# Altium schematic sheet PowerBoard.SchDoc
size A4
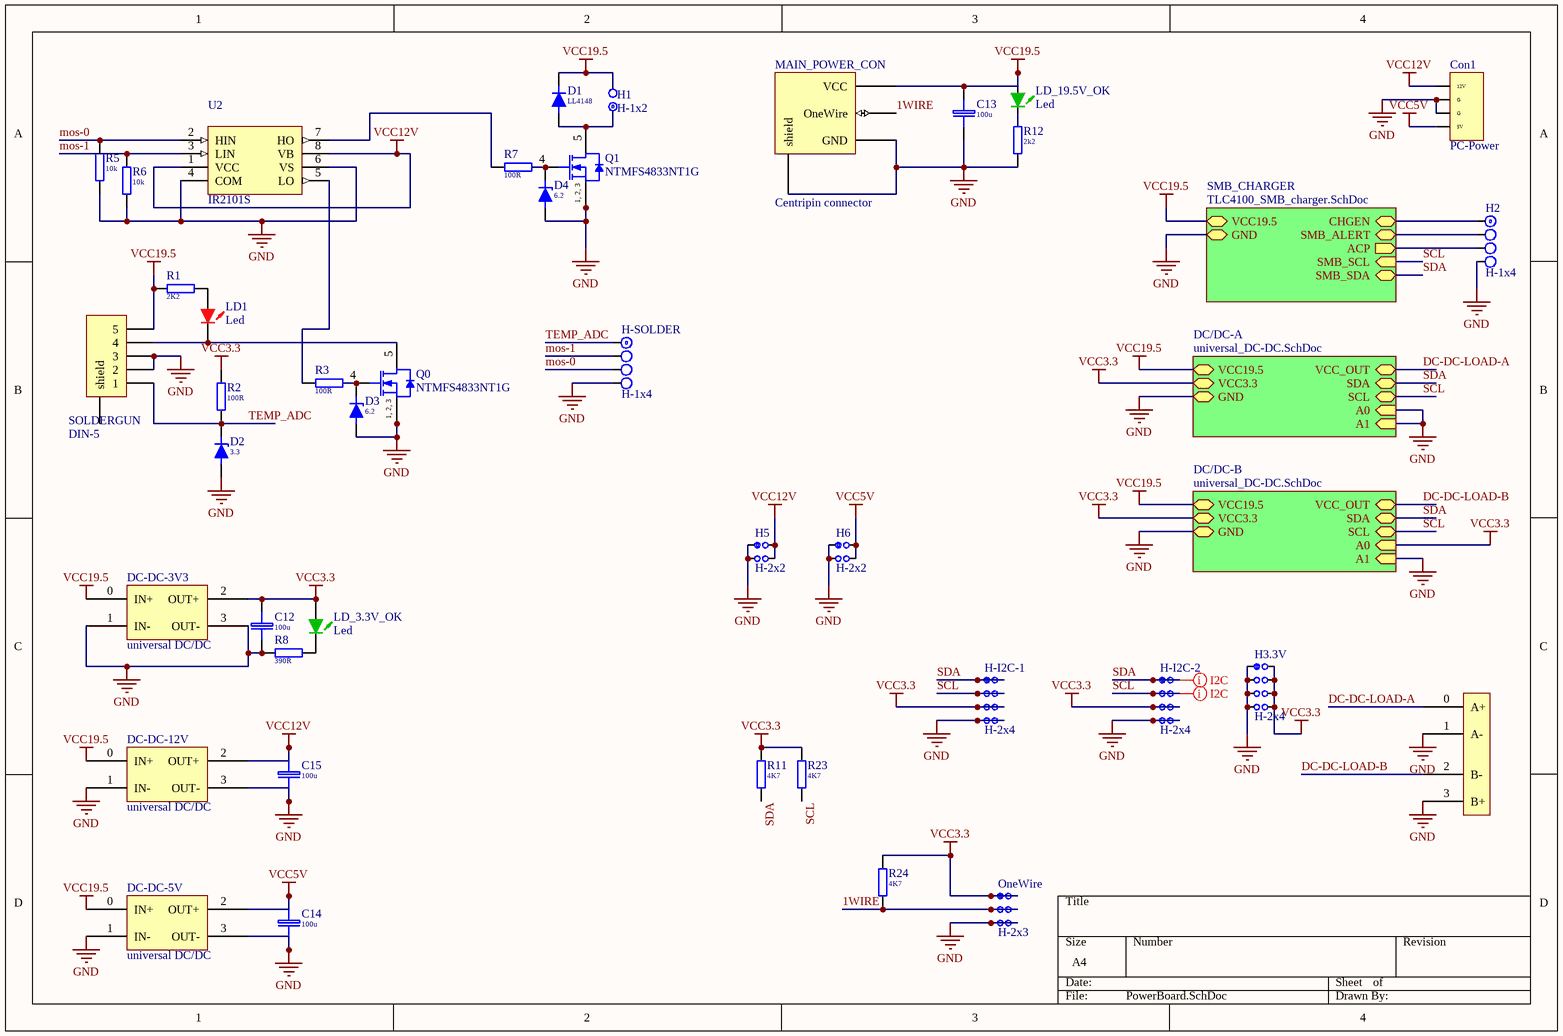
[diagram p0: PowerBoard.SchDoc]

## Parts
C12  100u  [EL SMD Case G D10x10.3 h10.2(1010)]
C13  100u  [EL SMD Case G D10x10.3 h10.2(1010)]
C14  100u  [EL SMD Case G D10x10.3 h10.2(1010)]
C15  100u  [EL SMD Case G D10x10.3 h10.2(1010)]
Con1  PC-Power  [PC-Power 4x5.08]
CON_DC_DC  Speaker terminal 4P  [Speaker termina 4x DPS]  (value not drawn)
D1  LL4148  [Micro-Melf]
D2  3.3  [SOD323]
D3  6.2  [SOD323]
D4  6.2  [SOD323]
DC-DC-3V3  universal DC/DC  [MP1584EN dc/dc 3A vertical]
DC-DC-5V  universal DC/DC  [MP1584EN dc/dc 3A vertical]
DC-DC-12V  universal DC/DC  [MP1584EN dc/dc 3A vertical]
H1  H-1x2  [J1x2]
H2  H-1x4  [J1x4]
H3.3V  H-2x4  [J2x4]
H5  H-2x2  [J2x2]
H6  H-2x2  [J2x2]
H-I2C-1  H-2x4  [J2x4]
H-I2C-2  H-2x4  [J2x4]
H-SOLDER  H-1x4  [J1x4]
LD1  Led  [Led 0805-Red]
LD_3.3V_OK  Led  [Led 0805-Green]
LD_19.5V_OK  Led  [Led 0805-Green]
MAIN_POWER_CON  Centripin connector  [Dell_centripin]
OneWire  H-2x3  [J2x3]
Q0  NTMFS4833NT1G  [ONSC-DFN-5-488AA_V]
Q1  NTMFS4833NT1G  [ONSC-DFN-5-488AA_V]
R1  2K2  [R0805]
R2  100R  [R0805]
R3  100R  [R0805]
R5  10k  [R0805]
R6  10k  [R0805]
R7  100R  [R0805]
R8  390R  [R0805]
R11  4K7  [R0805]
R12  2k2  [R0805]
R23  4K7  [R0805]
R24  4K7  [R0805]
SOLDERGUN  DIN-5  [DIN-5]
U2  IR2101S  [SO-8_L]

## Sub-sheets
DC/DC-A = universal_DC-DC.SchDoc: VCC3.3, SDA, GND, VCC19.5, VCC_OUT, A0 (in), A1 (in), SCL
DC/DC-B = universal_DC-DC.SchDoc: VCC3.3, SDA, GND, VCC19.5, VCC_OUT, A0 (in), A1 (in), SCL
SMB_CHARGER = TLC4100_SMB_charger.SchDoc: SMB_ALERT, CHGEN, ACP (out), VCC19.5, SMB_SCL (in), SMB_SDA, GND

## Nets
GND: C12.2(-) C13.2(-) C14.2(-) C15.2(-) Con1.2(G) Con1.3(G) CON_DC_DC.1(A-) CON_DC_DC.3(B+) D2.1(A) D3.1(A) D4.1(A) DC-DC-3V3.1(IN-) DC-DC-3V3.3(OUT-) DC-DC-5V.1(IN-) DC-DC-5V.3(OUT-) DC-DC-12V.1(IN-) DC-DC-12V.3(OUT-) H2.4 H3.3V.1 H3.3V.3 H3.3V.5 H3.3V.7 H5.1 H5.3 H6.1 H6.3 H-I2C-1.7 H-I2C-1.8 H-I2C-2.7 H-I2C-2.8 H-SOLDER.4 MAIN_POWER_CON.0(shield) MAIN_POWER_CON.1(GND) OneWire.5 OneWire.6 Q0.1(S) Q0.2(S) Q0.3(S) Q1.1(S) Q1.2(S) Q1.3(S) R5.1 R6.1 R8.2 R12.2 SOLDERGUN.2 SOLDERGUN.3 U2.4(COM) U2.6(VS) ; sheet SMB_CHARGER/GND, sheet DC/DC-A/GND, sheet DC/DC-A/A0, sheet DC/DC-A/A1, sheet DC/DC-B/GND, sheet DC/DC-B/A1
VCC3.3: C12.1(+) DC-DC-3V3.2(OUT+) H3.3V.2 H3.3V.4 H3.3V.6 H3.3V.8 H-I2C-1.5 H-I2C-1.6 H-I2C-2.5 H-I2C-2.6 LD_3.3V_OK.1(A) OneWire.1 OneWire.2 R2.2 R11.2 R23.2 R24.2 ; sheet DC/DC-A/VCC3.3, sheet DC/DC-B/VCC3.3, sheet DC/DC-B/A0
VCC5V: C14.1(+) Con1.1(5V) DC-DC-5V.2(OUT+) H6.2 H6.4
VCC12V: C15.1(+) Con1.4(12V) DC-DC-12V.2(OUT+) H5.2 H5.4 U2.1(VCC) U2.8(VB)
VCC19.5: C13.1(+) D1.2(C) DC-DC-3V3.0(IN+) DC-DC-5V.0(IN+) DC-DC-12V.0(IN+) H1.2 LD_19.5V_OK.1(A) MAIN_POWER_CON.3(VCC) R1.2 SOLDERGUN.5 ; sheet SMB_CHARGER/VCC19.5, sheet DC/DC-A/VCC19.5, sheet DC/DC-B/VCC19.5
1WIRE: MAIN_POWER_CON.2(OneWire) OneWire.3 OneWire.4 R24.1
DC-DC-LOAD-A: CON_DC_DC.0(A+) ; sheet DC/DC-A/VCC_OUT
DC-DC-LOAD-B: CON_DC_DC.2(B-) ; sheet DC/DC-B/VCC_OUT
mos-0: H-SOLDER.3 R5.2 U2.2(HIN)
mos-1: H-SOLDER.2 R6.2 U2.3(LIN)
SCL: H-I2C-1.3 H-I2C-1.4 H-I2C-2.3 H-I2C-2.4 R23.1 ; sheet SMB_CHARGER/SMB_SCL, sheet DC/DC-A/SCL, sheet DC/DC-B/SCL
SDA: H-I2C-1.1 H-I2C-1.2 H-I2C-2.1 H-I2C-2.2 R11.1 ; sheet SMB_CHARGER/SMB_SDA, sheet DC/DC-A/SDA, sheet DC/DC-B/SDA
TEMP_ADC: D2.2(C) H-SOLDER.1 R2.1 SOLDERGUN.1
NetD1_1: D1.1(A) H1.1 Q1.5(D)
NetD3_2: D3.2(C) Q0.4(G) R3.1
NetD4_2: D4.2(C) Q1.4(G) R7.1
NetH2_1: H2.1 ; sheet SMB_CHARGER/CHGEN
NetH2_2: H2.2 ; sheet SMB_CHARGER/SMB_ALERT
NetH2_3: H2.3 ; sheet SMB_CHARGER/ACP
NetLD1_1: LD1.1(A) R1.1
NetLD1_2: LD1.2(K) Q0.5(D) SOLDERGUN.4
NetLD_3.3V_OK_2: LD_3.3V_OK.2(K) R8.1
NetLD_19.5V_OK_2: LD_19.5V_OK.2(K) R12.1
NetR3_2: R3.2 U2.5(LO)
NetR7_2: R7.2 U2.7(HO)

Not connected (* = marked no-connect by the designer): SOLDERGUN 0(shield)

## Layout directives
net class I2C: SCL, SDA

## Notes on the sheet
- (in symbol NTMFS4833NT1G) 1, 2, 3

## Library data of the parts
C12-C15 = EL 100u/35V: EL 35V SMD Case G D10x10.3h10.5; Price: 0.014; Value: 100u
Con1 = PC-Power 4x5.08: Price: 0.07
D1 = MCL4148: SMD Micro-Melf 75V 0.3A; Price: 0.006
D2 = ZD3.3: 3.3V 0.2W; Price: 0.1; Value: 3.3
D3 D4 = ZD6.2: 6.2V 0.2W; Price: 0.1; Value: 6.2
LD1 = Led 0805 KP-2012EC: Red  627nm 12mcd; Price: 0.09
LD_3.3V_OK LD_19.5V_OK = Led 0805 KP-2012SGC: Green 565nm 15mcd; Price: 0.09
Q0 Q1 = NTMFS4833NT1G: Power MOSFET, 30 V, 191 A, Single N-Channel, 5-Pin DFN, Pb-Free, Tape and Reel; Manufacturer: On Semiconductor; Channel Polarity: N Channel; Ciss Typ (pF): 5600; Coss Typ (pF): 1200; Crss Typ (pF): 650; ID Max (A): 191; Qrr Typ (nC): 36; V(BR)DSS Min (V): 30; VGS Max (V): 20; VGS(th) Max (V): 2.5; DatasheetVersion: Rev. 9; PackageVersion: Rev. H, 03/2013; PackageReference: DFN-5-488AA; PackageDescription: 5-Pin Small Outline No-Lead, Body 4.9 x 5.9 mm, Pitch 1.27 mm; Configuration: Single; Package Type: SO-8FL / DFN-5; Packing: Tape and Reel; RoHS: Pb-Free; Mounting Technology: Surface Mount; Code_JEDEC: MO-240A; PartNumber: NTMFS4833NT1G; ComponentLink1Description: Manufacturer URL; ComponentLink1URL: http://www.onsemi.com/; ComponentLink2Description: Datasheet; ComponentLink2URL: http://www.onsemi.com/pub_link/Collateral/NTMFS4833N.PDF; ComponentLink3Description: Package Specification; ComponentLink3URL: http://www.onsemi.com/pub_link/Collateral/488AA.PDF
R1-R3 R5-R8 R11 R12 R23 R24 = R-0805: SMD 0805 0.1W 5% 150V; Price: 0.017
  R1: Value: 2K2
  R2 R3 R7: Value: 100R
  R5 R6: Value: 10k
  R8: Value: 390R
  R11 R23 R24: Value: 4K7
  R12: Value: 2k2
U2 = IR2101S: High and Low Side Driver; Published: 8-Jun-2000; LatestRevisionDate: 13-Apr-2006; LatestRevisionNote: IPC-7351 Footprint Added.; DatasheetVersion: PD60043J; PackageVersion: Feb-2001; PackageReference: SO-8; Publisher: Altium Limited; PackageDescription: 8-Pin Plastic Small Outline Integrated Circuit 1.27 mm Pitch; Code_JEDEC: MS-012-AA; Code_IPC: SOIC127P600-8; ComponentLink1Description: Manufacturer Link; ComponentLink1URL: http://www.irf.com/
H1 = H-1x2: Price: 0.02
H2 H-SOLDER = H-1x4: Price: 0.04
H3.3V H-I2C-1 H-I2C-2 = H-2x4: Price: 0.08
H5 H6 = H-2x2: Price: 0.04
OneWire = H-2x3: Price: 0.06